# Altium schematic sheet voltage_sensor_HiZ_HV.SchDoc
size A3
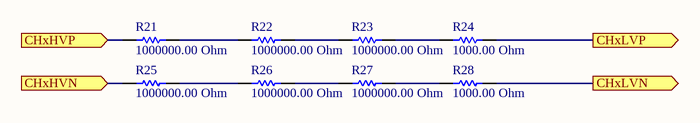
[diagram p0: voltage_sensor_HiZ_HV.SchDoc]

## Parts
R21  value 1000000.00 Ohm  [RESC1206(3216)_L]  (hidden comment: 1M 1% 1206(3216))
R22  value 1000000.00 Ohm  [RESC1206(3216)_L]  (hidden comment: 1M 1% 1206(3216))
R23  value 1000000.00 Ohm  [RESC1206(3216)_L]  (hidden comment: 1M 1% 1206(3216))
R24  value 1000.00 Ohm  [RESC1206(3216)_L]  (hidden comment: 1K 1% 1206(3216))
R25  value 1000000.00 Ohm  [RESC1206(3216)_L]  (hidden comment: 1M 1% 1206(3216))
R26  value 1000000.00 Ohm  [RESC1206(3216)_L]  (hidden comment: 1M 1% 1206(3216))
R27  value 1000000.00 Ohm  [RESC1206(3216)_L]  (hidden comment: 1M 1% 1206(3216))
R28  value 1000.00 Ohm  [RESC1206(3216)_L]  (hidden comment: 1K 1% 1206(3216))

## Ports
CHxHVN (in), CHxHVP (in), CHxLVN (out), CHxLVP (out)

## Nets
CHxHVN: R25.2 ; port CHxHVN
CHxHVP: R21.2 ; port CHxHVP
CHxLVN: R28.1 ; port CHxLVN
CHxLVP: R24.1 ; port CHxLVP
NetR21_1: R21.1 R22.2
NetR22_1: R22.1 R23.2
NetR23_1: R23.1 R24.2
NetR25_1: R25.1 R26.2
NetR26_1: R26.1 R27.2
NetR27_1: R27.1 R28.2

## Library data of the parts
R21-R23 R25-R27 = CMP-1014-00849-1: 1M 0.25W 1% 1206 (3216 Metric)  SMD; Case-EIA: 1206; Case-Metric: 3216; Tolerance: 1 %; Power: 0.25 W; Technology: SMT
R24 R28 = CMP-1014-00510-1: 1K 0.25W 1% 1206 (3216 Metric)  SMD; Case-Metric: 3216; Case-EIA: 1206; Power: 0.25 W; Tolerance: 1 %; Technology: SMT